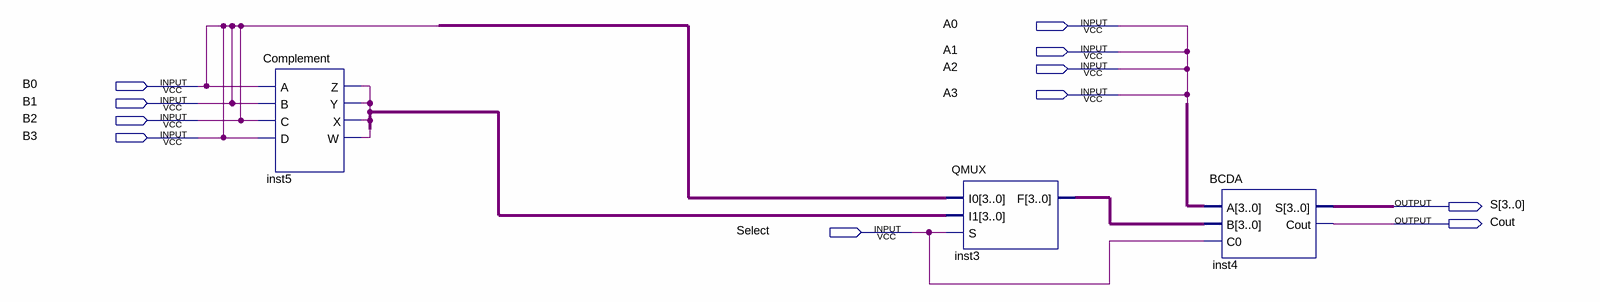
[diagram p0: schematic sheet]
// Quartus schematic Block_for_circuitsss.bdf as structural Verilog: 3 symbols, 11 pins
module Block_for_circuitsss (
  input  A0,
  input  A1,
  input  A2,
  input  B0,
  input  A3,
  input  B1,
  input  B2,
  input  B3,
  input  Select,
  output [3:0] S,
  output Cout
);

  wire inst5_w, inst5_x, inst5_z;
  wire [3:0] inst3_f, undriven, undriven_2, undriven_3;

  Complement inst5 (.A(B0), .B(B0), .C(B0), .D(B0), .Z(inst5_z), .Y(inst5_z), .X(inst5_x), .W(inst5_w));
  QMUX inst3 (.I0(undriven_2), .I1(undriven_3), .S(Select), .F(inst3_f));
  BCDA inst4 (.A(undriven), .B(inst3_f), .C0(Select), .S(S), .Cout(Cout));

  assign A1 = A0;
  assign A2 = A0;
  assign A3 = A0;
  assign B1 = B0;
  assign B2 = B0;
  assign B3 = B0;
endmodule
